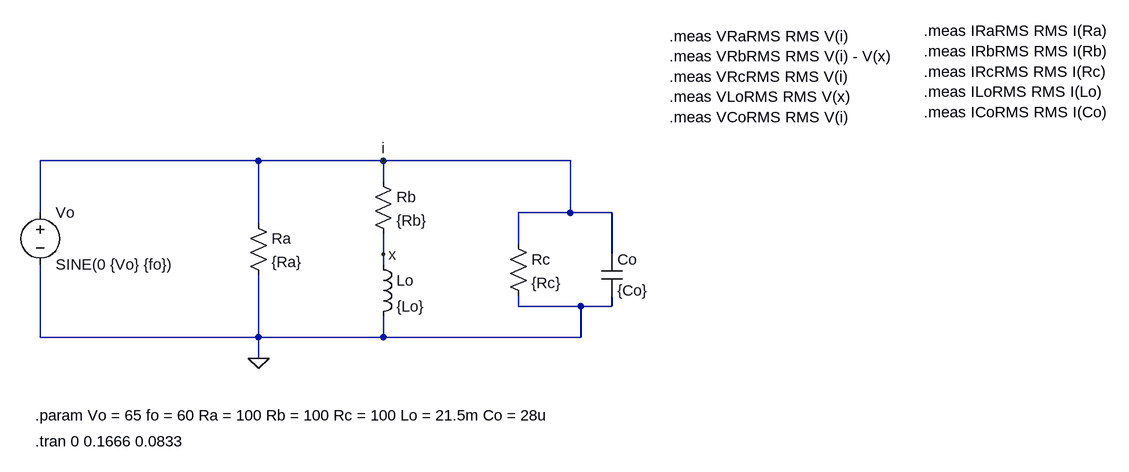
[diagram p0: schematic Lab_Bancada_1.asc]
Lab_Bancada_1.asc, the LTspice schematic file:
Version 4.1
SHEET 1 1612 680
WIRE 288 16 -48 16
WIRE 480 16 288 16
WIRE 768 16 480 16
WIRE 480 48 480 16
WIRE -48 96 -48 16
WIRE 768 96 768 16
WIRE 768 96 688 96
WIRE 832 96 768 96
WIRE 288 112 288 16
WIRE 688 144 688 96
WIRE 480 160 480 128
WIRE 832 160 832 96
WIRE 480 176 480 160
WIRE 688 240 688 224
WIRE 784 240 688 240
WIRE 832 240 832 224
WIRE 832 240 784 240
WIRE -48 288 -48 176
WIRE 288 288 288 192
WIRE 288 288 -48 288
WIRE 480 288 480 256
WIRE 480 288 288 288
WIRE 784 288 784 240
WIRE 784 288 480 288
WIRE 288 320 288 288
FLAG 288 320 0
FLAG 480 160 x
FLAG 480 16 i
SYMBOL voltage -48 80 R0
WINDOW 123 0 0 Left 0
WINDOW 39 0 0 Left 0
SYMATTR InstName Vo
SYMATTR Value SINE(0 {Vo} {fo})
SYMBOL res 272 96 R0
SYMATTR InstName Ra
SYMATTR Value {Ra}
SYMBOL res 464 32 R0
SYMATTR InstName Rb
SYMATTR Value {Rb}
SYMBOL ind 464 160 R0
SYMATTR InstName Lo
SYMATTR Value {Lo}
SYMBOL res 672 128 R0
SYMATTR InstName Rc
SYMATTR Value {Rc}
SYMBOL cap 816 160 R0
SYMATTR InstName Co
SYMATTR Value {Co}
TEXT -56 408 Left 2 !.param Vo = 65 fo = 60 Ra = 100 Rb = 100 Rc = 100 Lo = 21.5m Co = 28u
TEXT -56 448 Left 2 !.tran 0 0.1666 0.0833
TEXT 920 -176 Left 2 !.meas VRaRMS RMS V(i)\n.meas VRbRMS RMS V(i) - V(x)\n.meas VRcRMS RMS V(i)\n.meas VLoRMS RMS V(x)\n.meas VCoRMS RMS V(i)
TEXT 1312 -184 Left 2 !.meas IRaRMS RMS I(Ra)\n.meas IRbRMS RMS I(Rb)\n.meas IRcRMS RMS I(Rc)\n.meas ILoRMS RMS I(Lo)\n.meas ICoRMS RMS I(Co)

The netlist it stands for:
* Lab_Bancada_1.asc
Vo i 0 SINE(0 {Vo} {fo})
Ra i 0 {Ra}
Rb i x {Rb}
Lo x 0 {Lo}
Rc i 0 {Rc}
Co i 0 {Co}
.param Vo = 65 fo = 60 Ra = 100 Rb = 100 Rc = 100 Lo = 21.5m Co = 28u
.tran 0 0.1666 0.0833
.meas VRaRMS RMS V(i)
.meas VRbRMS RMS V(i) - V(x)
.meas VRcRMS RMS V(i)
.meas VLoRMS RMS V(x)
.meas VCoRMS RMS V(i)
.meas IRaRMS RMS I(Ra)
.meas IRbRMS RMS I(Rb)
.meas IRcRMS RMS I(Rc)
.meas ILoRMS RMS I(Lo)
.meas ICoRMS RMS I(Co)
.backanno
.end

* Results of the author's LTspice run, read from the files saved beside the schematic
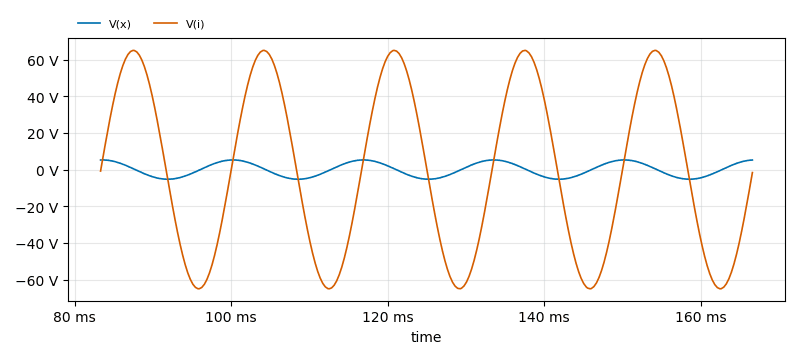
[diagram p1: Transient Analysis of Lab_Bancada_1.asc, plotted from the saved traces]
* Transient Analysis, 1 run:
*   V(x): min -5.253 V, max 5.252 V, average -2.081 mV, rms 3.713 V, last 5.223 V
*   V(i): min -65 V, max 65 V, average 419.5 µV, rms 45.97 V, last -1.633 V
* From the log:
*   vrarms: RMS(V(i))=45.9154643535 FROM 0 TO 0.0833
*   vrbrms: RMS(V(i) - V(x))=45.764693278 FROM 0 TO 0.0833
*   vrcrms: RMS(V(i))=45.9154643535 FROM 0 TO 0.0833
*   vlorms: RMS(V(i))=45.9154643535 FROM 0 TO 0.0833
*   vcorms: RMS(V(i))=45.9154643535 FROM 0 TO 0.0833
*   irarms: RMS(I(Ra))=0.459154641266 FROM 0 TO 0.0833
*   irbrms: RMS(I(Rb))=0.45764693215 FROM 0 TO 0.0833
*   ircrms: RMS(I(Rc))=0.459154641266 FROM 0 TO 0.0833
*   ilorms: RMS(I(Lo))=0.45764693215 FROM 0 TO 0.0833
*   icorms: RMS(I(Co))=0.484641576984 FROM 0 TO 0.0833